# Altium schematic sheet lab4.SchDoc
size A4
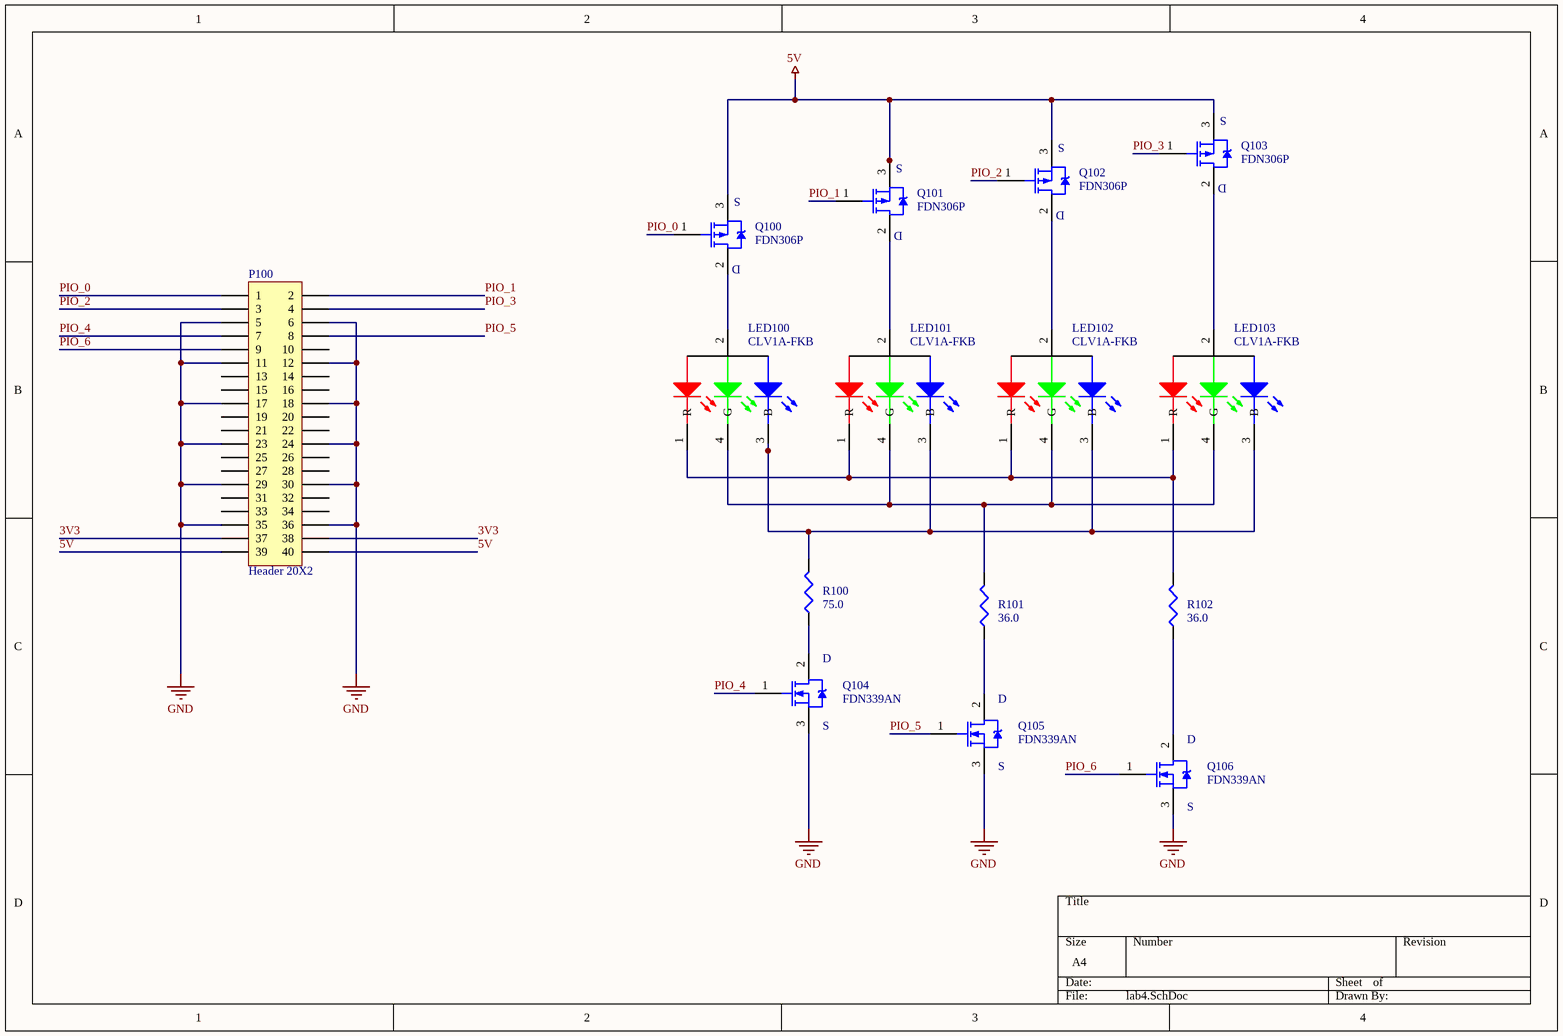
[diagram p0: lab4.SchDoc]

## Parts
LED100  CLV1A-FKB  [PLCC4]
LED101  CLV1A-FKB  [PLCC4]
LED102  CLV1A-FKB  [PLCC4]
LED103  CLV1A-FKB  [PLCC4]
P100  Header 20X2  [HDR2X20]
Q100  FDN306P  [SOT23-3M]
Q101  FDN306P  [SOT23-3M]
Q102  FDN306P  [SOT23-3M]
Q103  FDN306P  [SOT23-3M]
Q104  FDN339AN  [SOT23-3M]
Q105  FDN339AN  [SOT23-3M]
Q106  FDN339AN  [SOT23-3M]
R100  value 75.0  [RESC2012M]  (hidden comment: Res3)
R101  value 36.0  [RESC2012M]  (hidden comment: Res3)
R102  value 36.0  [RESC2012M]  (hidden comment: Res3)

## Nets
5V: P100.39 P100.40 Q100.3(S) Q101.3(S) Q102.3(S) Q103.3(S)
GND: P100.5 P100.6 P100.11 P100.12 P100.17 P100.18 P100.23 P100.24 P100.29 P100.30 P100.35 P100.36 Q104.3(S) Q105.3(S) Q106.3(S)
3V3: P100.37 P100.38
PIO_0: P100.1 Q100.1(G)
PIO_1: P100.2 Q101.1(G)
PIO_2: P100.3 Q102.1(G)
PIO_3: P100.4 Q103.1(G)
PIO_4: P100.7 Q104.1(G)
PIO_5: P100.8 Q105.1(G)
PIO_6: P100.9 Q106.1(G)
NetLED100_1: LED100.1(R) LED101.1(R) LED102.1(R) LED103.1(R) R102.2
NetLED100_2: LED100.2(A) Q100.2(D)
NetLED100_3: LED100.3(B) LED101.3(B) LED102.3(B) LED103.3(B) R100.2
NetLED100_4: LED100.4(G) LED101.4(G) LED102.4(G) LED103.4(G) R101.2
NetLED101_2: LED101.2(A) Q101.2(D)
NetLED102_2: LED102.2(A) Q102.2(D)
NetLED103_2: LED103.2(A) Q103.2(D)
NetQ104_2: Q104.2(D) R100.1
NetQ105_2: Q105.2(D) R101.1
NetQ106_2: Q106.2(D) R102.1

Not connected (* = marked no-connect by the designer): P100 10 13 14 15 16 19 20 21 22 25 26 27 28 31 32 33 34

## Library data of the parts
P100 = Header 20X2: Header, 20-Pin, Dual row; LatestRevisionDate: 17-Jul-2002; LatestRevisionNote: Re-released for DXP Platform.; Publisher: Altium Limited
Q100-Q103 = FDN304P: Pch MOSFET; pin to pad: 2>3 3>2
Q104-Q106 = FDN339AN: Nch MOSFET; pin to pad: 2>3 3>2
R100-R102 = Res3: Resistor; Published: 8-Jun-2000; LatestRevisionDate: 29-May-2009; LatestRevisionNote: IPC-7351 Footprint Added.; PackageReference: J1-0603; Publisher: Altium Limited; PackageDescription: Chip Resistor